# EAGLE design NaNd_synth_v0.1 (EAGLE 6.5.0)
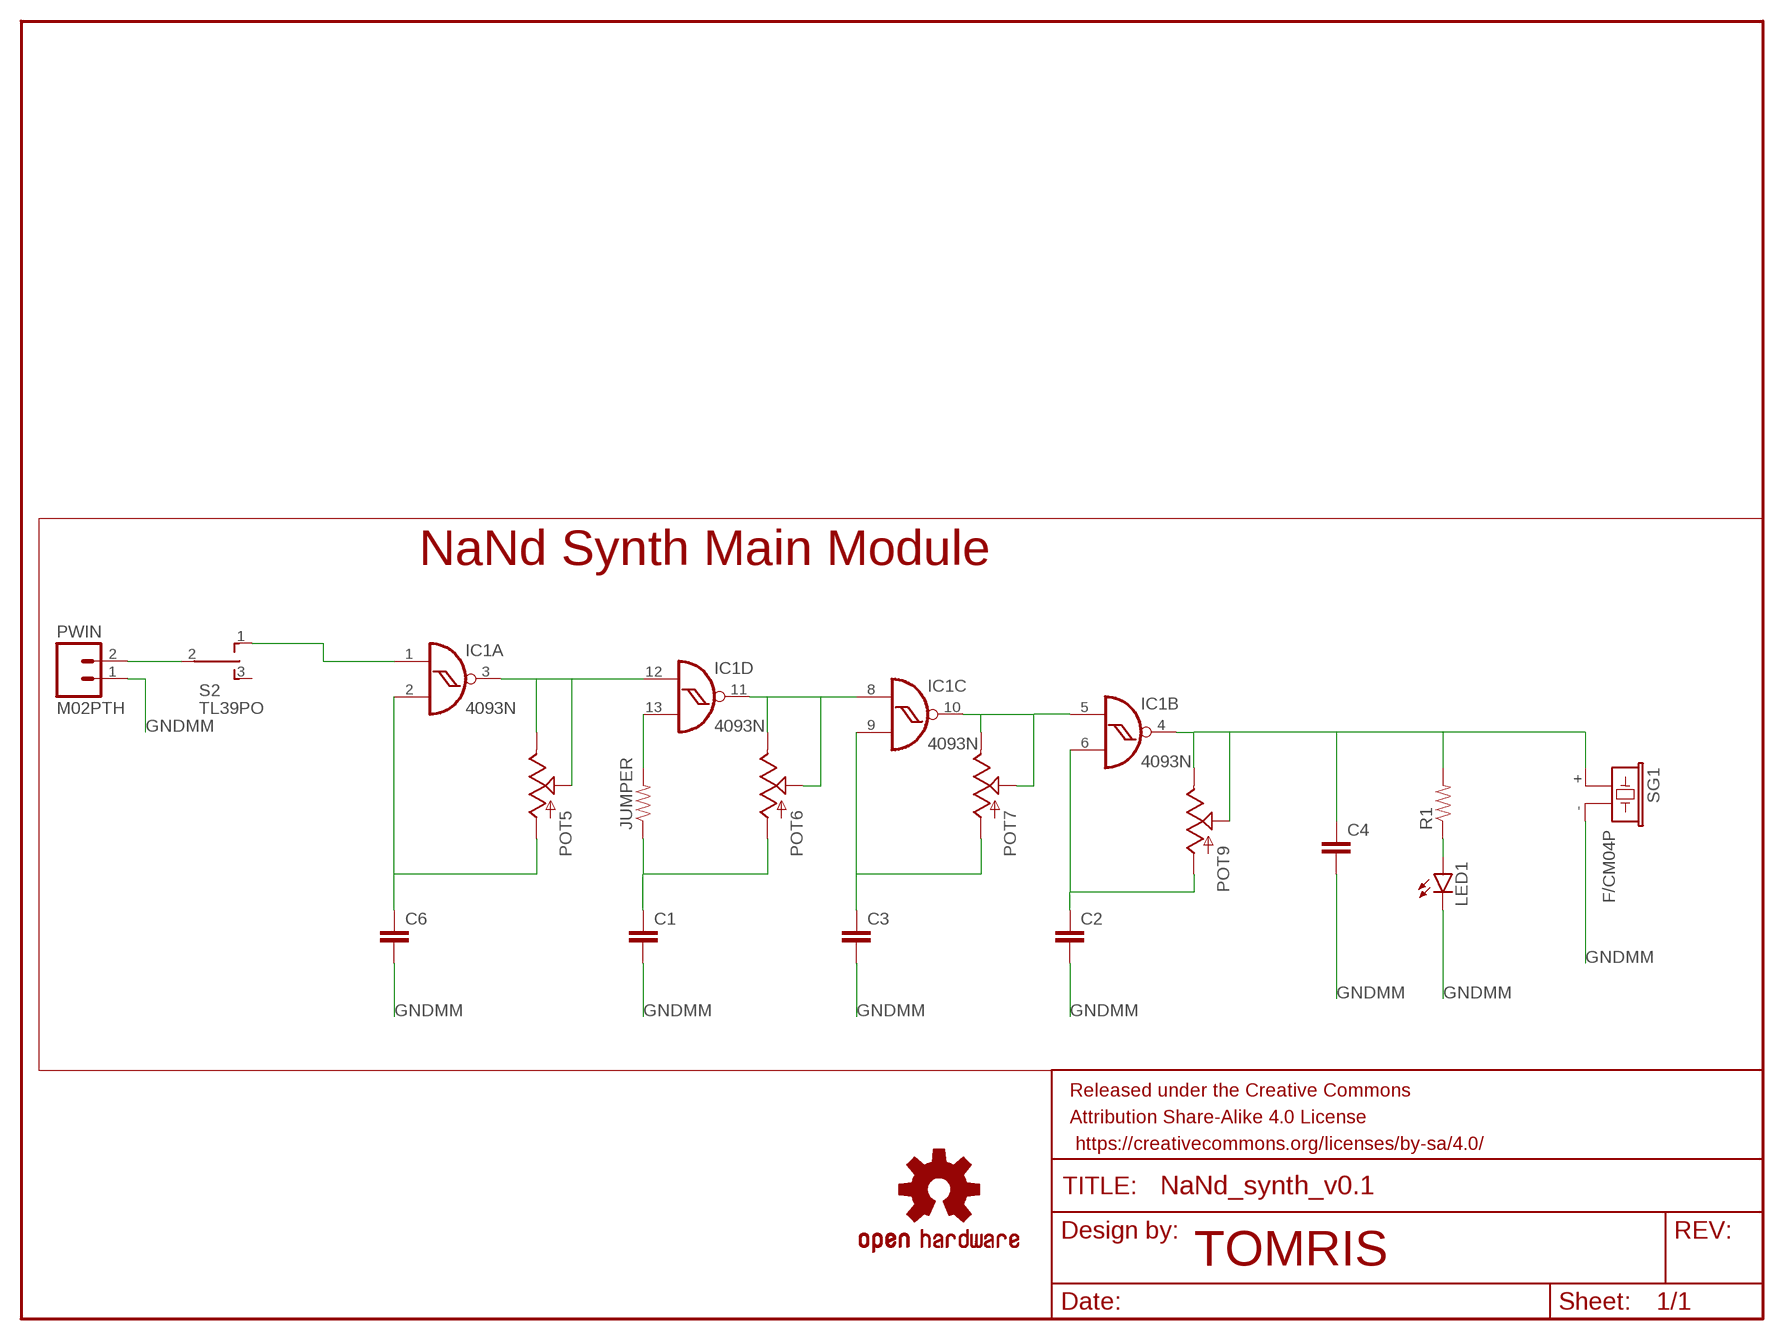
[diagram p0: schematic, sheet 1]

## Parts
C1  CAPPTH1  [CAP-PTH-5MM]
C2  CAPPTH1  [CAP-PTH-5MM]
C3  CAPPTH1  [CAP-PTH-5MM]
C4  CAPPTH1  [CAP-PTH-5MM]
C6  CAPPTH1  [CAP-PTH-5MM]
FRAME1  FRAME-LETTER  [CREATIVE_COMMONS]
IC1  4093N  [DIL14]
JUMPER  RESISTORAXIAL-0.3  [AXIAL-0.3]
LED1  LED-3MM-NO_SILK  [LED3MM-NS]
LOGO1  OSHW-LOGOM  [OSHW-LOGO-M]
POT5  POTMAM  [POT_MAMMOTH]
POT6  POTMAM  [POT_MAMMOTH]
POT7  POTMAM  [POT_MAMMOTH]
POT9  POTMAM  [POT_MAMMOTH]
PWIN  M02PTH  [1X02]
R1  RESISTORAXIAL-0.3  [AXIAL-0.3]
S2  TL39PO  [TL3XPO]
SG1  F/CM04P  [F/CM04P]

## Nets
GNDMM: C1.2 C2.2 C3.2 C4.2 C6.2 LED1.K(C) PWIN.1 SG1.-
N$1: C3.1 IC1.9(C:I1) POT7.P$2(A)
N$2: C2.1 IC1.6(B:I1) POT9.P$2(A)
N$3: LED1.A R1.P$1
N$4: PWIN.2 S2.2(P)
N$5: IC1.1(A:I0) S2.1(O)
N$6: IC1.13(D:I1) JUMPER.P$2
POTL2I: C6.1 IC1.2(A:I1) POT5.P$2(A)
POTL3I: IC1.3(A:O) IC1.12(D:I0) POT5.P$1(S) POT5.P$3(E)
POTL4I: IC1.8(C:I0) IC1.11(D:O) POT6.P$1(S) POT6.P$3(E)
POTL6I: C1.1 JUMPER.P$1 POT6.P$2(A)
POTL10I: IC1.5(B:I0) IC1.10(C:O) POT7.P$1(S) POT7.P$3(E)
POTL11I: C4.1 IC1.4(B:O) POT9.P$1(S) POT9.P$3(E) R1.P$2 SG1.+
Unconnected: S2.3(S)

## Notes on the sheet
- NaNd Synth Main Module
- TOMRIS

## Power pins joined to a net without a drawn wire
VDD: IC1.14(P:VDD)
VSS: IC1.7(P:VSS)

## Library data of the parts
C1-C4 C6 = SparkFun-Capacitors:CAP: Capacitor Standard 0603 ceramic capacitor, and 0.1" leaded capacitor.
FRAME1 = SparkFun-Aesthetics:FRAME-LETTER: Schematic Frame Standard 8.5x11 US Letter frame
IC1 = 40xx:4093: Quad 2-input NAND schmitt trigger
JUMPER R1 = SparkFun-Resistors:RESISTOR: Resistor Basic schematic elements and footprints for 0603, 1206, and PTH resistors.
LED1 = SparkFun-LED:LED: LEDs Standard schematic elements and footprints for 5mm, 3mm, 1206, and 0603 sized LEDs. 5mm - Spark Fun Electronics SKU : COM-00529 (and others)
LOGO1 = OSHW-LOGO-M-BOTTOMCOP:OSHW-LOGO: Open Source Hardware Logo This logo indicates the piece of hardware it is found on incorporates a OSHW license and/or adheres to the definition of open source hardware found here: http://freedomdefined.org/OSHW
POT5-POT7 POT9 = SparkFun-Electromechanical:POT
PWIN = SparkFun-Connectors:M02: Standard 2-pin 0.1" header. Use with - straight break away headers ( PRT-00116) - right angle break away headers (PRT-00553) - swiss pins (PRT-00743) - machine pins (PRT-00117) - female headers (PRT-00115) Molex polarized connector foot print use with: PRT-08233 with associated crimp pins and housings. 2.54_SCREWTERM for use with PRT-10571. 3.5mm Screw Terminal footprints for PRT-08084 5mm Screw Terminal footprints for use with PRT-08432
S2 = switch:TL39PO: TINY SWITCH ON OFF ON Source: http://www2.produktinfo.conrad.com/datenblaetter/700000-724999/705152-da-01-de-Subminiaturschalter_TL_36YO.pdf
SG1 = buzzer:F/CM04P: BUZZER Source: Buerklin; OC_FARNELL: unknown; OC_NEWARK: unknown

## Board
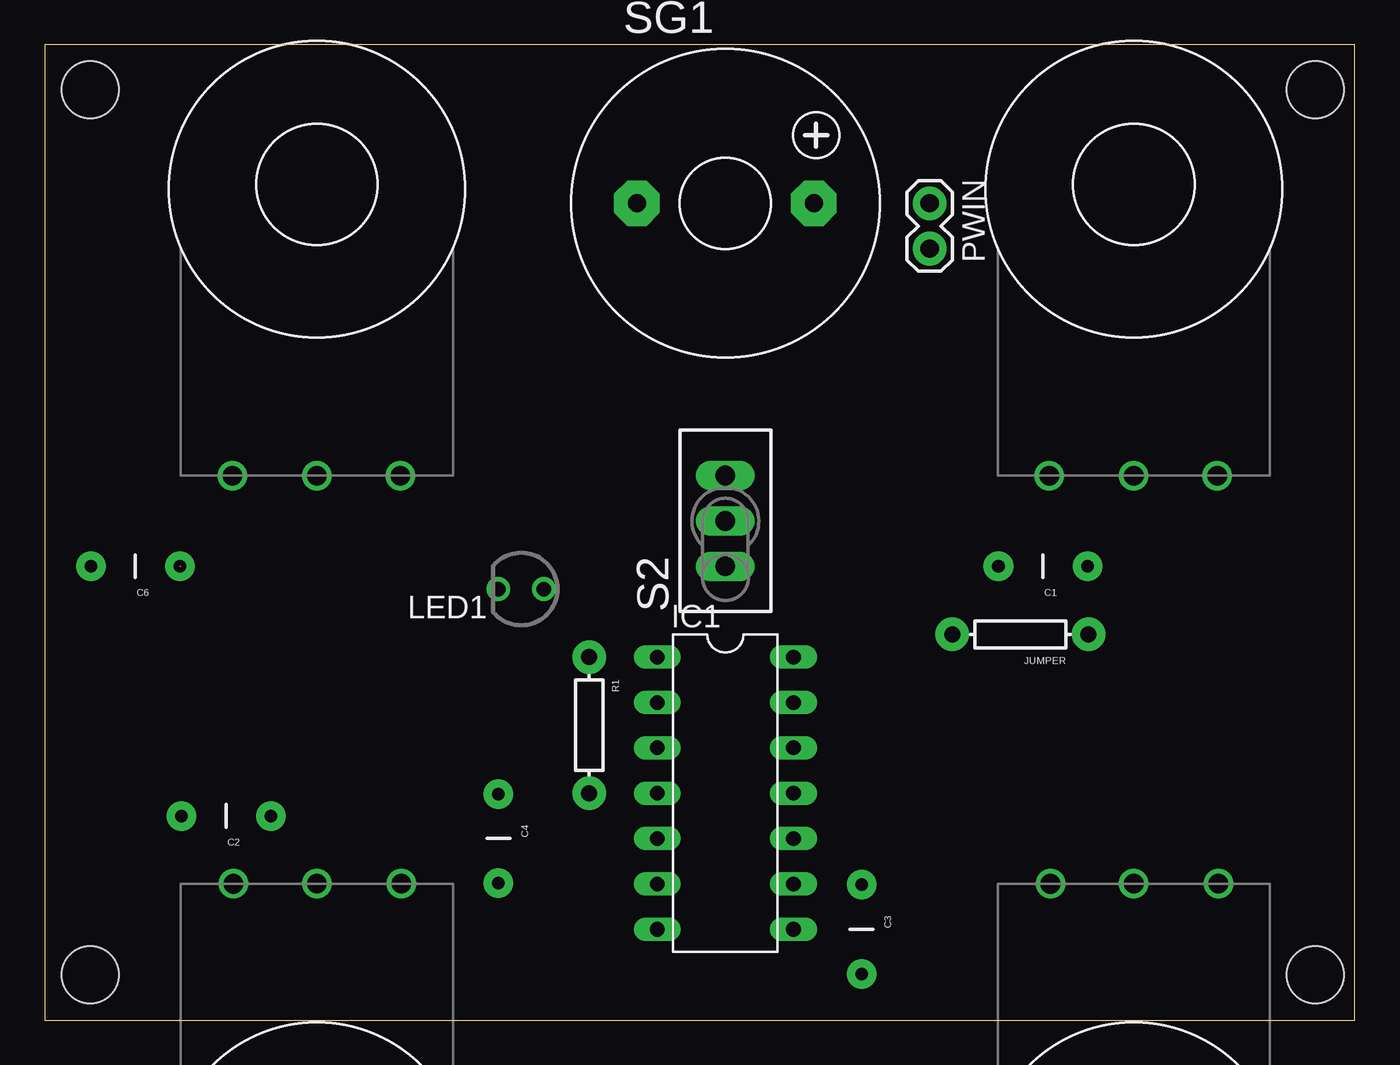
[diagram p1: board, top side]
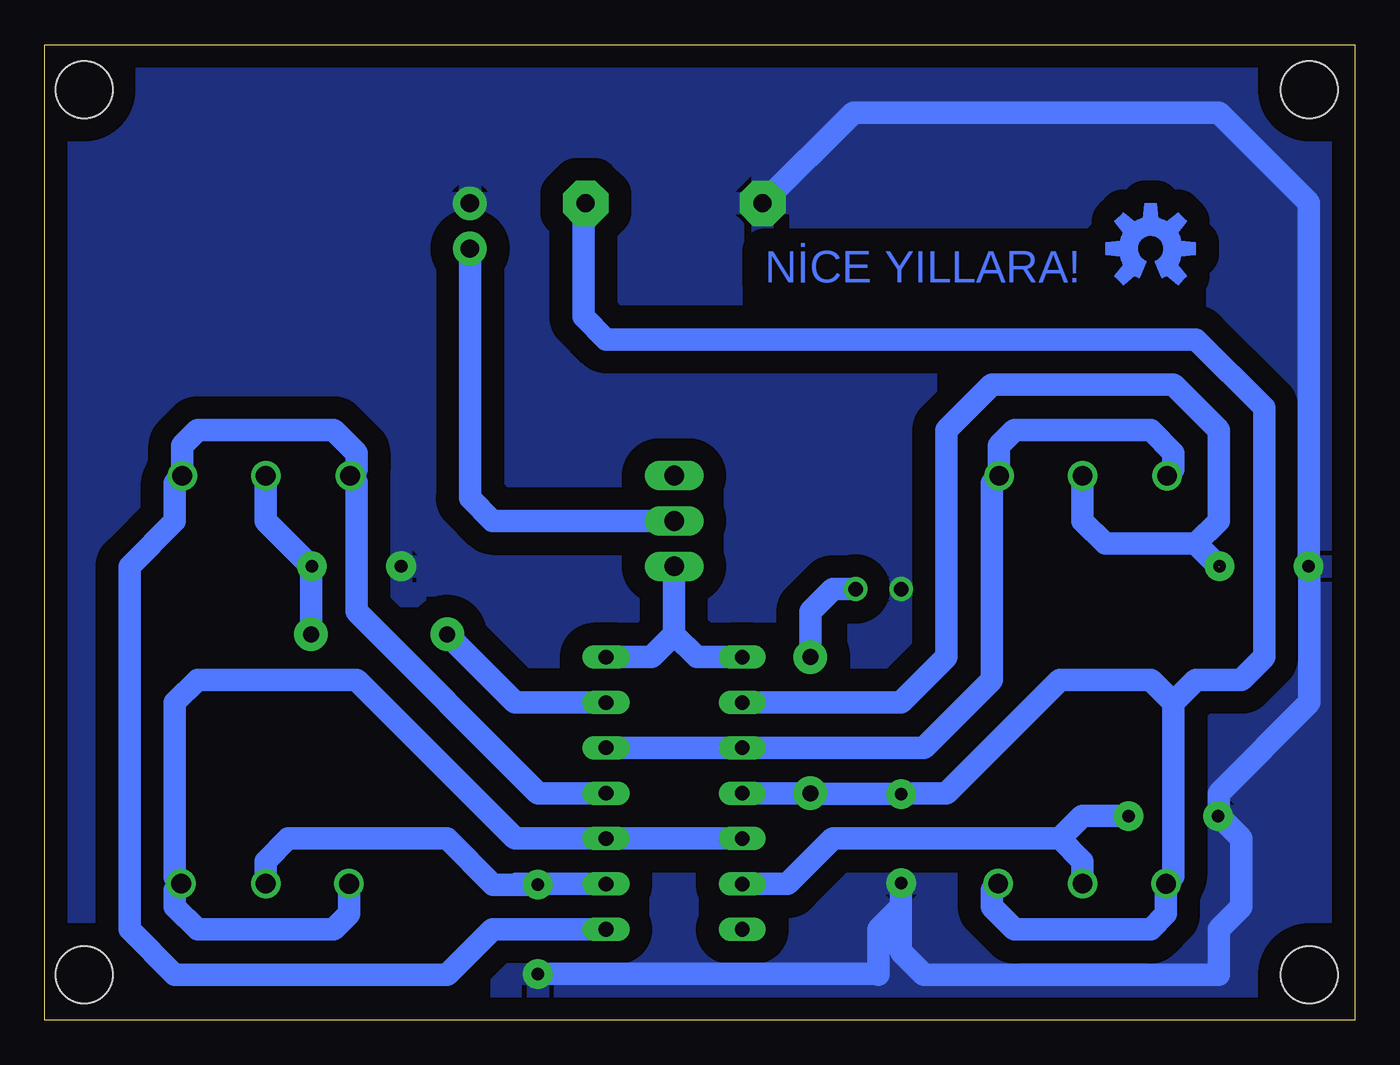
[diagram p2: board, bottom side, seen from below]

Size 73.33 x 54.6 mm. Coordinates in mm from the lower left corner, seen from the top.
Outline: 0,0 73.33,0 73.33,54.6 0,54.6 0,0
Copper layers (1*16): Top 0.035mm / dielectric 1.5mm / Bottom 0.035mm
Design rules "default": minimum track width 10mil, minimum drill 24mil, track to track 8mil, track to pad 8mil, pad to pad 8mil, via to via 8mil, smd to smd 8mil, copper to edge 40mil, drill to drill 8mil, minimum pad ring 10mil, minimum via ring 8mil, stop-mask expansion 4mil, vias tented up to drill 0mil, thermal gap 10mil
Holes 3.2 mm at 2.54,2.54 2.54,52.07 71.12,52.07 71.12,2.54

### Footprints (pad centres in the part's own frame; a part is rotated, then mirrored left to right if it is on the bottom)
CAP-PTH-5MM = drill 0.7 pad 1.651: 1 -2.5,0; 2 2.5,0
DIL14 = drill 0.813 long: 1 -7.62,-3.81; 2 -5.08,-3.81; 3 -2.54,-3.81; 4 0,-3.81; 5 2.54,-3.81; 6 5.08,-3.81; 7 7.62,-3.81; 8 7.62,3.81; 9 5.08,3.81; 10 2.54,3.81; 11 0,3.81; 12 -2.54,3.81; 13 -5.08,3.81; 14 -7.62,3.81
AXIAL-0.3 = drill 0.9 pad 1.88: P$1 -3.81,0; P$2 3.81,0
LED3MM-NS = drill 0.813: A -1.27,0; K 1.27,0
POT_MAMMOTH = drill 1.1: P$1 -4.73,-0.02; P$2 0,-0.02; P$3 4.67,-0.01
1X02 = drill 1.016 pad 1.88: 1 0,0; 2 2.54,0
TL3XPO = drill 1.1 pad 1.422 long: 1 -2.54,0; 2 0,0; 3 2.54,0
F/CM04P = drill 1.016 pad 2.54 octagon: + 4.953,0; - -4.953,0

### Placement (x,y rotation side)
C1  55.88,25.4 180 top
C2  10.16,11.43 180 top
C3  45.72,5.08 270 top
C4  25.4,10.16 270 top
C6  5.08,25.4 180 top
FRAME1  20.32,-25.4 0 top  (outside the outline)
IC1  38.1,12.7 270 top
JUMPER  54.61,21.59 180 top
LED1  26.67,24.13 180 top
LOGO1  11.43,43.18 0 top
POT5  15.24,30.48 0 top
POT6  60.96,30.48 0 top
POT7  60.96,7.62 180 top
POT9  15.24,7.62 180 top
PWIN  49.53,45.72 270 top
R1  30.48,16.51 270 top
S2  38.1,27.94 90 top
SG1  38.1,45.72 0 top

### Tracks (layer width: path | path; a pad name or v marks a point on that pad's centre or on a via)
GNDMM
  Bottom 1.27: C3.2 26.71,2.58 26.67,2.54 26.67,5.08 25.4,6.35 C4.2 25.4,3.81 24.13,2.54 7.62,2.54 7.62,5.08 6.35,6.35 6.35,10.16 7.62,11.43 7.62,12.7 2.54,17.78 2.54,25.36 C6.2 2.58,45.76 7.62,50.8 28.07,50.8 SG1.-
  pour Bottom (isolate 1.27): 0,54.61 0,0 73.66,0 73.66,54.61
N$1
  Bottom 1.27: IC1.9 46.95,7.62 C3.1 48.22,7.58 50.8,10.16 59.69,10.16 60.96,8.89 POT7.P$2
N$2
  Bottom 1.27: 16.51,10.16 15.24,11.43 C2.1 | POT9.P$2 15.24,8.89 16.51,10.16 | IC1.6 31.75,7.62 29.21,10.16 16.51,10.16
N$3
  Bottom 1.27: R1.P$1 30.48,22.86 29.21,24.13 LED1.A
N$4
  Bottom 1.27: PWIN.2 49.53,29.21 48.26,27.94 S2.2
N$5
  Bottom 1.27: IC1.1 36.83,20.32 38.1,21.59 | 41.91,20.32 39.37,20.32 38.1,21.59 | 38.1,21.59 S2.1
N$6
  Bottom 1.27: IC1.13 46.99,17.78 JUMPER.P$2
POTL2I  (1 unrouted)
  Bottom 1.27: IC1.2 25.4,17.78 22.86,20.32 22.86,33.02 20.32,35.56 10.16,35.56 7.62,33.02 7.62,27.94 8.89,26.67 | POT5.P$2 15.24,27.94 13.97,26.67 8.89,26.67 | 7.62,25.4 8.89,26.67
POTL3I
  Bottom 1.27: POT5.P$1 10.16,30.81 10.16,31.75 11.43,33.02 19.05,33.02 19.91,32.16 POT5.P$3 20.32,30.06 20.32,19.05 24.13,15.24 IC1.3 IC1.12
POTL4I
  Bottom 1.27: IC1.11 45.72,12.7 55.88,22.86 55.88,30.11 POT6.P$1 55.88,30.81 55.88,31.75 57.15,33.02 64.77,33.02 65.63,32.16 POT6.P$3 66.04,30.06 66.04,27.94 68.58,25.4 68.58,5.08 66.04,2.54 50.8,2.54 48.26,5.08 IC1.8
POTL6I
  Bottom 1.27: JUMPER.P$1 58.42,25.36 C1.1 58.42,25.4 60.96,27.94 POT6.P$2
POTL10I
  Bottom 1.27: POT7.P$3 56.29,5.94 57.15,5.08 64.77,5.08 66.04,6.35 66.04,7.29 POT7.P$1 66.04,7.99 66.04,17.78 64.77,19.05 55.88,19.05 46.99,10.16 IC1.10 IC1.5
POTL11I
  Bottom 1.27: IC1.4 R1.P$2 30.44,12.66 C4.1 25.36,12.7 22.86,12.7 16.51,19.05 11.43,19.05 10.16,17.78 | POT9.P$1 20.32,7.29 20.32,6.35 19.05,5.08 11.43,5.08 10.57,5.94 POT9.P$3 10.16,8.04 10.16,17.78 | 10.16,17.78 8.89,19.05 6.35,19.05 5.08,20.32 5.08,34.29 8.89,38.1 41.91,38.1 43.18,39.37 43.18,45.59 SG1.+

### Text on the board
Bottom: NİCE YILLARA!
tTest: Tomris